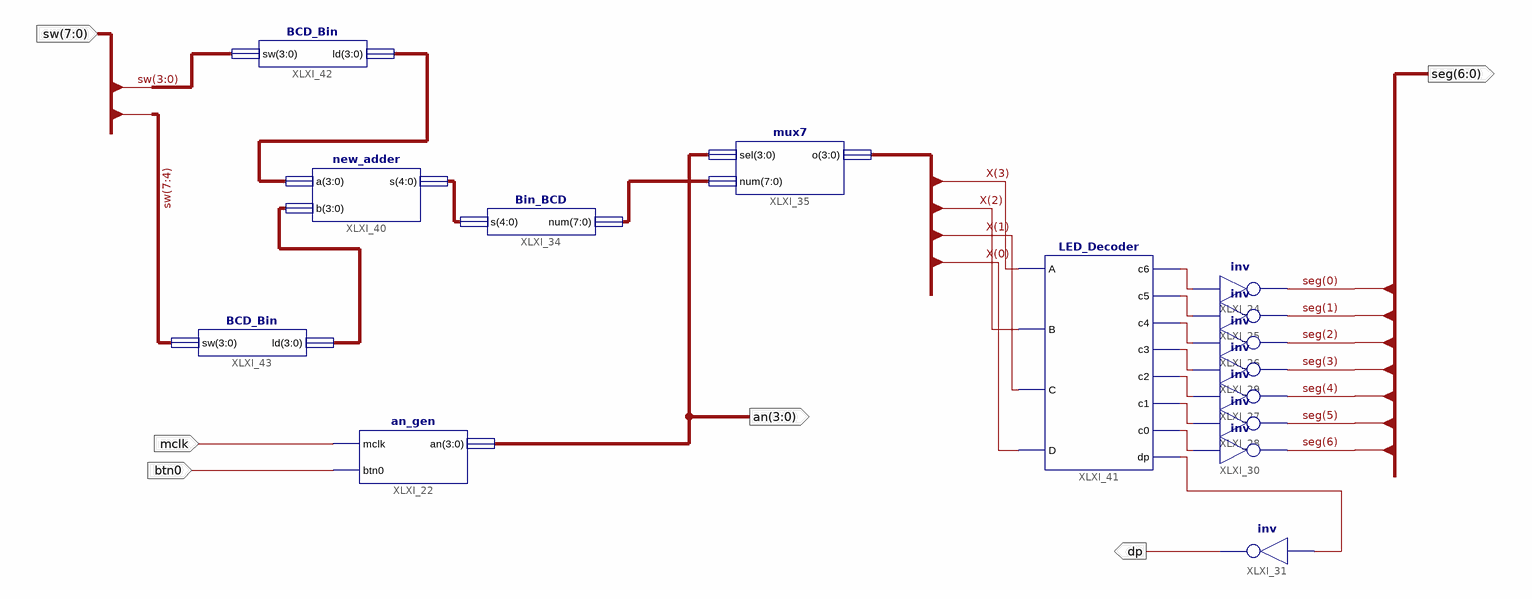
[diagram p0: schematic sheet 1]
// Xilinx ISE schematic main2.sch (spartan3e) as structural Verilog: 15 symbols, 6 ports
module main2 (
  input  mclk,
  input  btn0,
  input  [7:0] sw,
  output [3:0] an,
  output [6:0] seg,
  output dp
);

  wire XLXN_54, XLXN_55, XLXN_56, XLXN_57, XLXN_58, XLXN_59, XLXN_60, XLXN_72;
  wire [3:0] X, XLXN_80, XLXN_81;
  wire [4:0] XLXN_31;
  wire [7:0] BCD;

  an_gen XLXI_22 (.mclk(mclk), .btn0(btn0), .an(an));
  not XLXI_24 (seg[0], XLXN_54);
  not XLXI_25 (seg[1], XLXN_55);
  not XLXI_26 (seg[2], XLXN_56);
  not XLXI_27 (seg[4], XLXN_58);
  not XLXI_28 (seg[5], XLXN_59);
  not XLXI_29 (seg[3], XLXN_57);
  not XLXI_30 (seg[6], XLXN_60);
  not XLXI_31 (dp, XLXN_72);
  Bin_BCD XLXI_34 (.s(XLXN_31), .num(BCD));
  mux7 XLXI_35 (.sel(an), .num(BCD), .o(X));
  new_adder XLXI_40 (.a(XLXN_80), .b(XLXN_81), .s(XLXN_31));
  LED_Decoder XLXI_41 (
    .A(X[3]), .B(X[2]), .C(X[1]), .D(X[0]), .c6(XLXN_54), .c5(XLXN_55), .c4(XLXN_56), .c3(XLXN_57),
    .c2(XLXN_58), .c1(XLXN_59), .c0(XLXN_60), .dp(XLXN_72));
  BCD_Bin XLXI_42 (.sw(sw[3:0]), .ld(XLXN_80));
  BCD_Bin XLXI_43 (.sw(sw[7:4]), .ld(XLXN_81));
endmodule
